# EAGLE schematic Horn_Circuit (EAGLE 6.5.0)
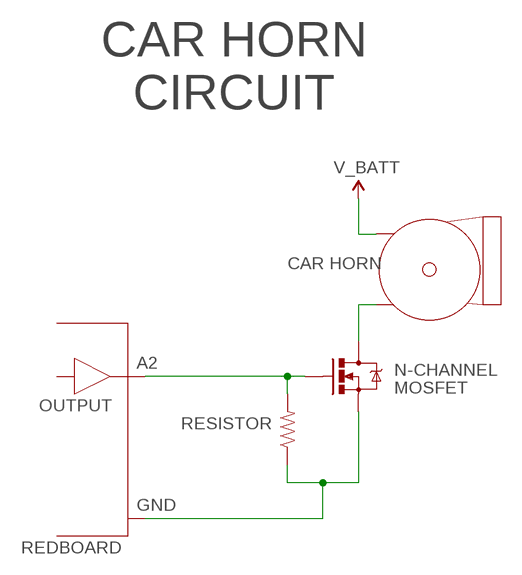
[diagram p0: schematic, sheet 1]

## Parts
MOSFET  MOSFET-NCHANNELFQP30N06L  [TO220V]
RESISTOR  RESISTORPTH-1/6W  [1/6W-RES]

## Nets
N$1: MOSFET.2(D)
N$2: MOSFET.1(G) RESISTOR.2
N$3: MOSFET.3(S) RESISTOR.1

## Notes on the sheet
- CAR HORN
  CIRCUIT
- CAR HORN
- A2
- N-CHANNEL
- OUTPUT
- GND
- REDBOARD

## Library data of the parts
MOSFET = SparkFun-DiscreteSemi:MOSFET-NCHANNEL: Common NMOSFET Parts MFG P/N Store ID Prod ID FDD8780 TRANS-09984 SI7820DN TRANS-11055 FDS6630A IC-08089 2N7002PW TRANS-11151 FQP30N06L COM-10213 TRANS-10060 BSS123LT1G TRANS-08345 BSS138 TRANS-00830 BS170 2N7000; PROD_ID: TRANS-10060
RESISTOR = SparkFun-Resistors:RESISTOR: Resistor Basic schematic elements and footprints for 0603, 1206, and PTH resistors.